# Altium schematic sheet 00-Hierarchy.SchDoc
size A4; Author: Fabian Castaño; CompanyName: GIBIC Tech-Hub; Engineer: Fabian Castaño; Organization: Universidad de Antioquia; Address1: UdeA; Address2: Medellín; Address3: Antioquia; Address4: Colombia 050010
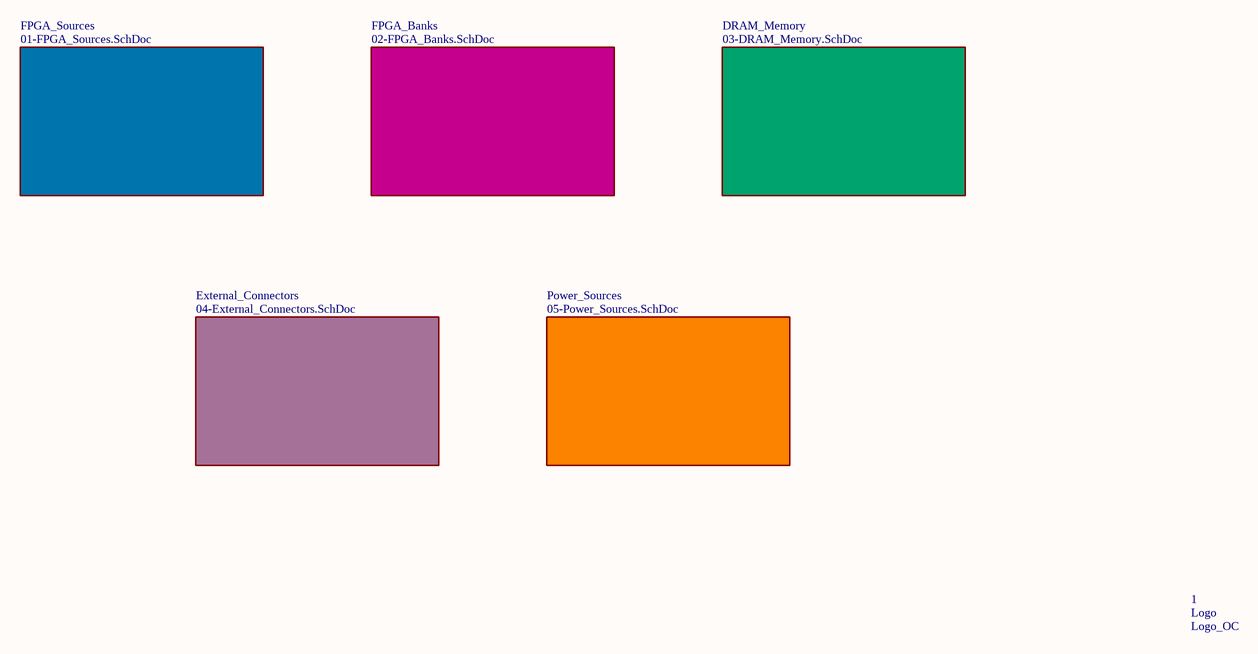
[diagram p0: 00-Hierarchy.SchDoc]

## Parts
1  Logo_OC  [PCBComponent_1]

## Sub-sheets
DRAM_Memory = 03-DRAM_Memory.SchDoc: no entries
External_Connectors = 04-External_Connectors.SchDoc: no entries
FPGA_Banks = 02-FPGA_Banks.SchDoc: no entries
FPGA_Sources = 01-FPGA_Sources.SchDoc: no entries
Power_Sources = 05-Power_Sources.SchDoc: no entries

## Notes on the sheet
- Title
- Size:
- Date:
- A4
- Enginner:
- Time:
- Revision:
- Sheet
- of
- Author:
- File:
- (in symbol Logo_OC) Logo